# Altium schematic sheet ClimaSens-Sensor.SchDoc
size A4
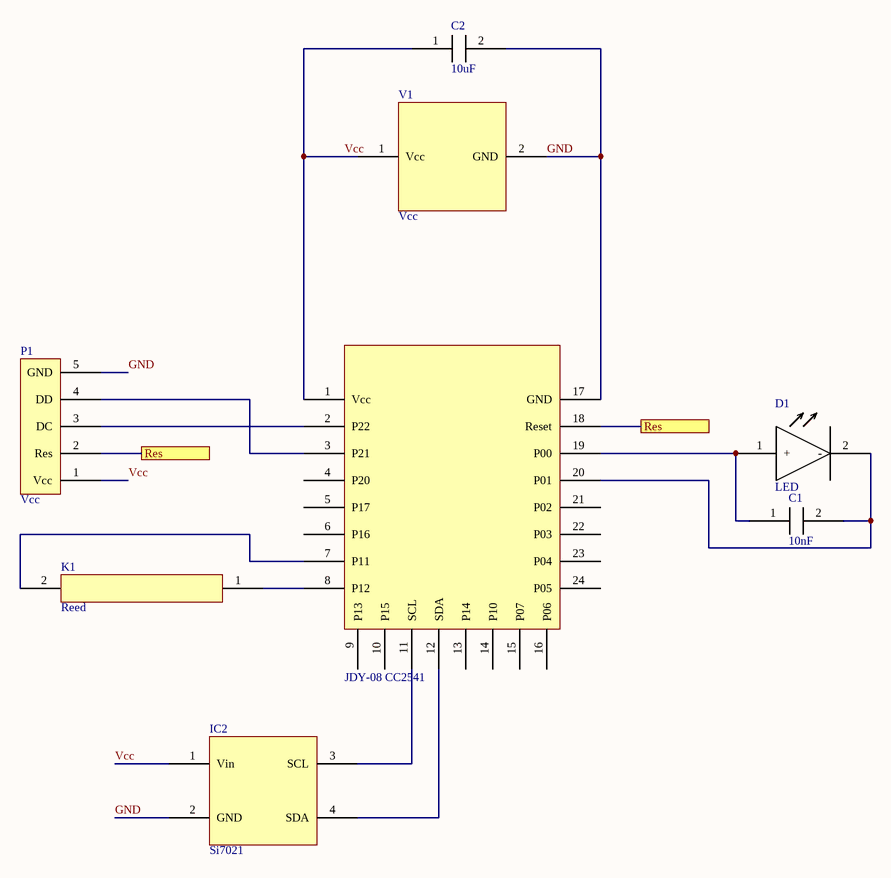
[diagram p0: ClimaSens-Sensor.SchDoc]

## Parts
?  JDY-08 CC2541  [JDY-08 CC2541]
C1  10nF  [0805]
C2  10uF  [0805]
D1  LED  [LED 3mm]
IC2  Si7021  [Si7021]
K1  Reed  [Reed]
P1  Vcc  [ProgramPort]
V1  Vcc  [Battery-Clip]

## Ports
Res

## Nets
GND: ?.17(GND) C2.2 IC2.2(GND) P1.5(GND) V1.2(GND)
Res: ?.18(Reset) P1.2(Res) ; port Res
Vcc: ?.1(Vcc) C2.1 IC2.1(Vin) P1.1(Vcc) V1.1(Vcc)
Net?_2: ?.2(P22) P1.3(DC)
Net?_3: ?.3(P21) P1.4(DD)
Net?_7: ?.7(P11) K1.2
Net?_8: ?.8(P12) K1.1
Net?_11: ?.11(SCL) IC2.3(SCL)
Net?_12: ?.12(SDA) IC2.4(SDA)
Net?_19: ?.19(P00) C1.1 D1.1(+)
Net?_20: ?.20(P01) C1.2 D1.2(-)

Not connected (* = marked no-connect by the designer): ? 4(P20) 5(P17) 6(P16) 9(P13) 10(P15) 13(P14) 14(P10) 15(P07) 16(P06) 21(P02) 22(P03) 23(P04) 24(P05)

## Library data of the parts
C1 C2 = Capacitator
P1 = ProgramPort
V1 = Battery Clip